# Altium schematic sheet UART.SchDoc
size A; SheetNumber: 4; SheetTotal: 6
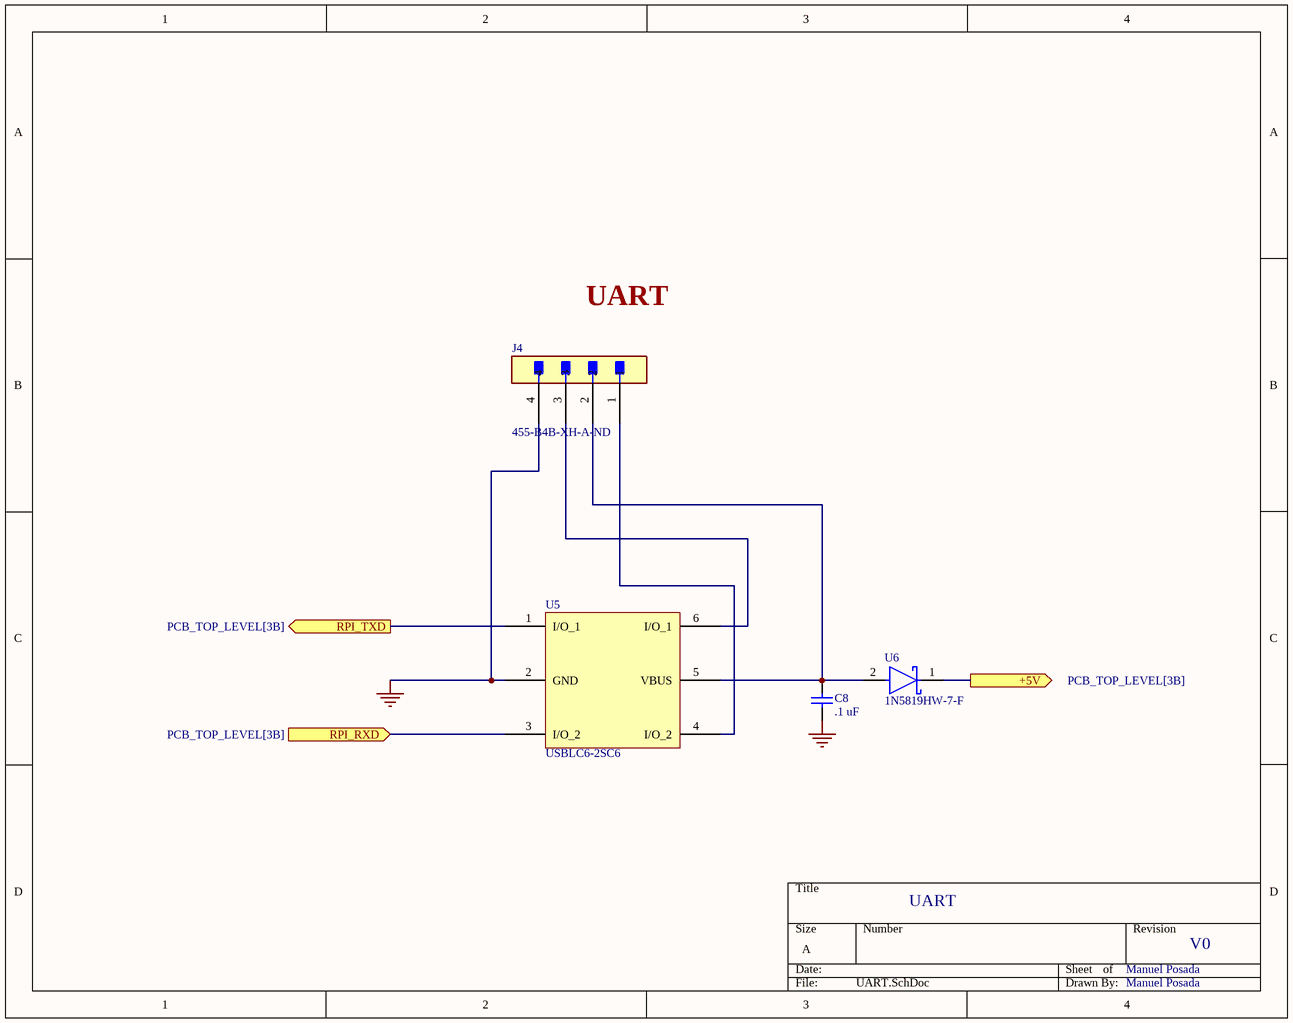
[diagram p0: UART.SchDoc]

## Parts
C8  .1 uF  [CAP_CL21_SAM-L]
J4  455-B4B-XH-A-ND  [CONN_B4B-XH-A_JST]
U5  USBLC6-2SC6  [SOT23-6L_STM]
U6  1N5819HW-7-F  [FP-SOD123-IPC_B]

## Ports
+5V (out, see PCB_TOP_LEVEL[3B]), RPI_RXD (in, see PCB_TOP_LEVEL[3B]), RPI_TXD (out, see PCB_TOP_LEVEL[3B])

## Nets
GND: C8.1 J4.4 U5.2(GND)
+5V: U6.1(C) ; port +5V
RPI_RXD: U5.3(I/O_2) ; port RPI_RXD
RPI_TXD: U5.1(I/O_1) ; port RPI_TXD
NetC8_2: C8.2 J4.2 U5.5(VBUS) U6.2(A)
NetJ4_1: J4.1 U5.4(I/O_2)
NetJ4_3: J4.3 U5.6(I/O_1)

## Notes on the sheet
- UART
- Manuel Posada
- V0

## Library data of the parts
C8 = CL21B104KBCNNNC: 50V 100nF X7R ±10% 0805 Multilayer Ceramic Capacitors MLCC - SMD/SMT ROHS; Manufacturer: Samsung Electro-Mechanics; Supplier: DigiKey; Supplier Part Number: 1276-1003-6-ND; Manufacturer Part Number: CL21B104KBCNNNC; RoHS: Compliant; Category: Ceramic Capacitors; Stock: 2859375; Pricing: 1=0.08, 10=0.006 (USD); Value: 100nF; Case/Package: 0805; Case Code (Imperial): 0805; Case Code (Metric): 2012; China RoHS: Compliant; Contact Plating: Tin; Country of Origin: Mainland China, Philippines, South Korea; Depth: 1.25mm; Dielectric: X7R; Dielectric Material: Ceramic; Export Control Classification Number (ECCN) Code: EAR99; Height: 950µm; Harmonized Tariff Schedule (HTS) Code: 8532.24.00.20; Introduction Date: 2009-07-27; Lead Free: Lead Free; Length: 2mm; Lifecycle Status: Production; Material: Ceramic; Max Operating Temperature: 125°C; Min Operating Temperature: -55°C; Mounting Technology: Surface Mount; Number of Terminals: 2; Radiation Hardening: No; REACH SVHC: Yes; Schedule B: 8532240020, 8532240020|8532240020, 8532240020|8532240020|8532240020, 8532240020|8532240020|8532240020|8532240020; Thickness: 939.8µm; Tolerance: 10%; Voltage: 50V; Voltage Rating: 50V; Voltage Rating (DC): 50V; Width: 1.25mm; ComponentLink1URL: https://datasheet.octopart.com:443/CL21B104KBCNNNC-Samsung-Electro-Mechanics-datasheet-137745078.pdf?src-supplier=IHS; ComponentLink1Description: https://datasheet.octopart.com:443/CL21B104KBCNNNC-Samsung-Electro-Mechanics-datasheet-137745078.pdf?src-supplier=IHS; ComponentLink2URL: https://datasheet.octopart.com/CL21B104KBCNNNC-Samsung-Electro-Mechanics-datasheet-8324245.pdf; ComponentLink2Description: https://datasheet.octopart.com/CL21B104KBCNNNC-Samsung-Electro-Mechanics-datasheet-8324245.pdf; ComponentLink3URL: https://datasheet.octopart.com/CL21B104KBCNNNC-Samsung-Electro-Mechanics-datasheet-97040617.pdf; ComponentLink3Description: https://datasheet.octopart.com/CL21B104KBCNNNC-Samsung-Electro-Mechanics-datasheet-97040617.pdf; ComponentLink4URL: https://datasheet.octopart.com:443/CL21B104KBCNNNC-Samsung-Electro-Mechanics-datasheet-11548950.pdf?src-supplier=Future+Electronics; ComponentLink4Description: https://datasheet.octopart.com:443/CL21B104KBCNNNC-Samsung-Electro-Mechanics-datasheet-11548950.pdf?src-supplier=Future+Electronics; ComponentLink5URL: https://datasheet.octopart.com:443/CL21B104KBCNNNC-Samsung-Electro-Mechanics-datasheet-116891032.pdf?src-supplier=Future+Electronics; ComponentLink5Description: https://datasheet.octopart.com:443/CL21B104KBCNNNC-Samsung-Electro-Mechanics-datasheet-116891032.pdf?src-supplier=Future+Electronics; ComponentLink6URL: https://datasheet.octopart.com:443/CL21B104KBCNNNC-Samsung-Electro-Mechanics-datasheet-81462175.pdf?src-supplier=Future+Electronics; ComponentLink6Description: https://datasheet.octopart.com:443/CL21B104KBCNNNC-Samsung-Electro-Mechanics-datasheet-81462175.pdf?src-supplier=Future+Electronics; ComponentLink7URL: https://datasheet.octopart.com:443/CL21B104KBCNNNC-Samsung-datasheet-42485244.pdf?src-supplier=Future+Electronics; ComponentLink7Description: https://datasheet.octopart.com:443/CL21B104KBCNNNC-Samsung-datasheet-42485244.pdf?src-supplier=Future+Electronics; ComponentLink8URL: https://datasheet.octopart.com:443/CL21B104KBCNNNC-Samsung-Electro-Mechanics-datasheet-149045937.pdf?src-supplier=Future+Electronics; ComponentLink8Description: https://datasheet.octopart.com:443/CL21B104KBCNNNC-Samsung-Electro-Mechanics-datasheet-149045937.pdf?src-supplier=Future+Electronics; ComponentLink9URL: https://datasheet.octopart.com:443/CL21B104KBCNNNC-Samsung-datasheet-8326407.pdf?src-supplier=TME; ComponentLink9Description: https://datasheet.octopart.com:443/CL21B104KBCNNNC-Samsung-datasheet-8326407.pdf?src-supplier=TME
J4 = B4B-XH-A: Board Connector, 4 Contact(s), 1 Row(s), Male, Straight, Solder Terminal; Manufacturer: JST; Contact Resistance: 20mΩ; Current Rating: 3A; Insulation Resistance: 1GΩ; Supplier: DigiKey; Supplier Part Number: 455-B4B-XH-A-ND; Manufacturer Part Number: B4B-XH-A; RoHS: Compliant; Category: Card Edge Connectors; Stock: 88606; Pricing: 1=0.14, 10=0.12, 100=0.1021, 500=0.09114, 1000=0.08679, 5000=0.07746, 10000=0.07376 (USD); Contact Gender: Male; Contact Material: Bronze, Tin; Export Control Classification Number (ECCN) Code: EAR99; Housing Material: Nylon; Harmonized Tariff Schedule (HTS) Code: 8536.69.40.40; Introduction Date: 1997-11-01; Lifecycle Status: Production; Max Operating Temperature: 85°C; Min Operating Temperature: -25°C; Pins: 4; Number of Rows: 1; Orientation: Straight; Terminal Pitch: 2.5mm; ComponentLink1URL: https://datasheet.octopart.com:443/B4B-XH-A-JST-datasheet-157850277.pdf?src-supplier=IHS; ComponentLink1Description: https://datasheet.octopart.com:443/B4B-XH-A-JST-datasheet-157850277.pdf?src-supplier=IHS; ComponentLink2URL: https://datasheet.octopart.com:443/B4B-XH-A-JST-datasheet-10026044.pdf?src-supplier=TME; ComponentLink2Description: https://datasheet.octopart.com:443/B4B-XH-A-JST-datasheet-10026044.pdf?src-supplier=TME
U5 = USBLC6-2SC6: 17V Clamp 5A (8/20µs) Ipp Tvs Diode Surface Mount SOT-23-6; Manufacturer: STMicroelectronics; Breakdown Voltage: 6V; Value: 2.5pF; Data Rate: 480Mbps; Direction: Unidirectional; Element Configuration: Dual; ESD Protection: Yes; Forward Voltage: 1.1V; Leakage Current: 150nA; Max Junction Temperature (Tj): 125°C; Max Repetitive Reverse Voltage (Vrrm): 5.25V; Number of Bidirectional Channels: 2; Number of Elements: 1; Reverse Standoff Voltage: 5V; Test Current: 1mA; Supplier: DigiKey; Supplier Part Number: 497-5235-1-ND; Manufacturer Part Number: USBLC6-2SC6; RoHS: Compliant; Category: TVS Diodes; Stock: 229189; Pricing: 1=0.36, 10=0.243, 100=0.163, 500=0.127, 1000=0.114, 3000=0.077, 6000=0.076, 9000=0.075 (USD); Case/Package: SOT-23; China RoHS: Compliant; Clamping Voltage: 17V; Contact Plating: Tin; Country of Origin: Mainland China; Depth: 1.75mm; Export Control Classification Number (ECCN) Code: EAR99; Height: 1.45mm; Harmonized Tariff Schedule (HTS) Code: 8541.10.00.50; Introduction Date: 2005-03-15; Lead Free: Lead Free; Length: 3.05mm; Lifecycle Status: Production; Max Breakdown Voltage: 6V; Max Operating Temperature: 125°C; Max Reverse Leakage Current: 150nA; Min Breakdown Voltage: 6V; Min Operating Temperature: -40°C; Mounting Technology: Surface Mount; Number of Channels: 2; Pins: 6; Number of Terminals: 6; Operating Supply Voltage: 1.1V; Peak Pulse Current: 5A; Peak Reverse Current: 150nA; Polarity: Unidirectional; Power Line Protection: Yes; Radiation Hardening: No; REACH SVHC: Yes; Reverse Breakdown Voltage: 6V; Schedule B: 8536300000, 8536300000|8536300000|8536300000|8536300000|8536300000|8536300000|8536300000|8536300000|8536300000|8536300000|8536300000|8536300000|8536300000|8536300000|8536300000|8536300000|8536300000|8536300000|8536300000|8536300000|8536300000|8536300000|8536300000|85; Termination: SMD/SMT; Width: 1.75mm; Working Voltage: 5V; ComponentLink1URL: https://datasheet.octopart.com:443/USBLC6-2SC6-STMicroelectronics-datasheet-10412581.pdf?src-supplier=Newark; ComponentLink1Description: https://datasheet.octopart.com:443/USBLC6-2SC6-STMicroelectronics-datasheet-10412581.pdf?src-supplier=Newark; ComponentLink2URL: https://datasheet.octopart.com:443/USBLC6-2SC6-STMicroelectronics-datasheet-181961833.pdf?src-supplier=Newark; ComponentLink2Description: https://datasheet.octopart.com:443/USBLC6-2SC6-STMicroelectronics-datasheet-181961833.pdf?src-supplier=Newark; ComponentLink3URL: https://datasheet.octopart.com:443/USBLC6-2SC6-STMicroelectronics-datasheet-525477.pdf?src-supplier=Factory+Futures; ComponentLink3Description: https://datasheet.octopart.com:443/USBLC6-2SC6-STMicroelectronics-datasheet-525477.pdf?src-supplier=Factory+Futures; ComponentLink4URL: https://datasheet.octopart.com:443/USBLC6-2SC6-STMicroelectronics-datasheet-82998616.pdf?src-supplier=Farnell; ComponentLink4Description: https://datasheet.octopart.com:443/USBLC6-2SC6-STMicroelectronics-datasheet-82998616.pdf?src-supplier=Farnell; ComponentLink5URL: https://datasheet.octopart.com:443/USBLC6-2SC6-STMicroelectronics-datasheet-46285.pdf?src-supplier=Farnell; ComponentLink5Description: https://datasheet.octopart.com:443/USBLC6-2SC6-STMicroelectronics-datasheet-46285.pdf?src-supplier=Farnell; ComponentLink6URL: https://datasheet.octopart.com:443/USBLC6-2SC6-STMicroelectronics-datasheet-14050643.pdf?src-supplier=iiiC; ComponentLink6Description: https://datasheet.octopart.com:443/USBLC6-2SC6-STMicroelectronics-datasheet-14050643.pdf?src-supplier=iiiC; ComponentLink7URL: https://datasheet.octopart.com:443/USBLC6-2SC6-STMicroelectronics-datasheet-10521292.pdf?src-supplier=Jameco; ComponentLink7Description: https://datasheet.octopart.com:443/USBLC6-2SC6-STMicroelectronics-datasheet-10521292.pdf?src-supplier=Jameco
U6 = 1N5819HW-7-F: DIODE SCHOTTKY 40V 1A SOD123; Manufacturer: Diodes Inc.; Value: 50pF; Element Configuration: Single; Forward Voltage: 750mV; Max Forward Surge Current (Ifsm): 25A; Max Junction Temperature (Tj): 125°C; Max Power Dissipation: 450mW; Number of Elements: 1; Peak Reverse Current: 1mA; Polarity: Standard; Supplier: DigiKey; Supplier Part Number: 1N5819HW-FDICT-ND; Manufacturer Part Number: 1N5819HW-7-F; RoHS: Compliant; Category: Schottky Diodes; Stock: 184558; Pricing: 1=0.29, 10=0.166, 100=0.1036, 500=0.07624, 1000=0.06736, 3000=0.0505, 6000=0.044, 9000=0.03923, 15000=0.039, 21000=0.03886, 30000=0.03872, 75000=0.03561, 150000=0.0323 (USD); Average Rectified Current: 1A; Case/Package: SOD-123-2; China RoHS: Compliant; Contact Plating: Tin; Current Rating: 1A; Forward Current: 1A; Height: 1.45mm; Lead Free: Lead Free; Length: 2.85mm; Lifecycle Status: Production; Max Operating Temperature: 125°C; Max Output current: 1A; Max Repetitive Reverse Voltage (Vrrm): 40V; Max Reverse Voltage (DC): 40V; Min Breakdown Voltage: 40V; Min Operating Temperature: -65°C; Pins: 2; Number of Terminals: 2; Output Current: 1A; Packaging: Tape and Reel; Peak Non-Repetitive Surge Current: 25A; Radiation Hardening: No; REACH SVHC: Yes; Reverse Standoff Voltage: 40V; Reverse Voltage: 40V; Schedule B: 8541100080, 8541100080|8541100080|8541100080|8541100080|8541100080; Termination: SMD/SMT; Voltage Rating (DC): 40V; Weight: 10.007382mg; Width: 1.7mm; ComponentLink1URL: https://datasheet.octopart.com:443/1N5819HW-7-F-Diodes-Inc.-datasheet-180549196.pdf?src-supplier=IHS; ComponentLink1Description: https://datasheet.octopart.com:443/1N5819HW-7-F-Diodes-Inc.-datasheet-180549196.pdf?src-supplier=IHS; ComponentLink2URL: https://datasheet.octopart.com:443/1N5819HW-7-F-Diodes-Inc.-datasheet-8332965.pdf?src-supplier=Upverter; ComponentLink2Description: https://datasheet.octopart.com:443/1N5819HW-7-F-Diodes-Inc.-datasheet-8332965.pdf?src-supplier=Upverter; ComponentLink3URL: https://sigma.octopart.com:443/138895985/technical_drawing/Diodes-Inc.-1N5819HW-7-F.pdf?src-supplier=Upverter; ComponentLink3Description: https://sigma.octopart.com:443/138895985/technical_drawing/Diodes-Inc.-1N5819HW-7-F.pdf?src-supplier=Upverter; ComponentLink4URL: https://datasheet.octopart.com:443/1N5819HW-7-F-Diodes-Inc.-datasheet-134530231.pdf?src-supplier=Future+Electronics; ComponentLink4Description: https://datasheet.octopart.com:443/1N5819HW-7-F-Diodes-Inc.-datasheet-134530231.pdf?src-supplier=Future+Electronics; ComponentLink5URL: https://datasheet.octopart.com:443/1N5819HW-7-F-Diodes-Inc.-datasheet-34441420.pdf?src-supplier=Future+Electronics; ComponentLink5Description: https://datasheet.octopart.com:443/1N5819HW-7-F-Diodes-Inc.-datasheet-34441420.pdf?src-supplier=Future+Electronics; ComponentLink6URL: https://datasheet.octopart.com:443/1N5819HW-7-F-Diodes-Inc.-datasheet-10497210.pdf?src-supplier=Future+Electronics; ComponentLink6Description: https://datasheet.octopart.com:443/1N5819HW-7-F-Diodes-Inc.-datasheet-10497210.pdf?src-supplier=Future+Electronics; ComponentLink7URL: https://datasheet.octopart.com:443/1N5819HW-7-F-Diodes-Inc.-datasheet-169364014.pdf?src-supplier=Newark; ComponentLink7Description: https://datasheet.octopart.com:443/1N5819HW-7-F-Diodes-Inc.-datasheet-169364014.pdf?src-supplier=Newark; ComponentLink8URL: https://datasheet.octopart.com:443/1N5819HW-7-F-Diodes-Inc.-datasheet-78715396.pdf?src-supplier=Newark; ComponentLink8Description: https://datasheet.octopart.com:443/1N5819HW-7-F-Diodes-Inc.-datasheet-78715396.pdf?src-supplier=Newark; ComponentLink9URL: https://datasheet.octopart.com:443/1N5819HW-7-F-Diodes-Inc.-datasheet-14053419.pdf?src-supplier=iiiC; ComponentLink9Description: https://datasheet.octopart.com:443/1N5819HW-7-F-Diodes-Inc.-datasheet-14053419.pdf?src-supplier=iiiC; ComponentLink10URL: https://datasheet.octopart.com:443/1N5819HW-7-F-Diodes-Inc.-datasheet-7274306.pdf?src-supplier=Jameco; ComponentLink10Description: https://datasheet.octopart.com:443/1N5819HW-7-F-Diodes-Inc.-datasheet-7274306.pdf?src-supplier=Jameco; ComponentLink11URL: https://datasheet.octopart.com:443/1N5819HW-7-F-Diodes-Inc.-datasheet-16627.pdf?src-supplier=Mouser; ComponentLink11Description: https://datasheet.octopart.com:443/1N5819HW-7-F-Diodes-Inc.-datasheet-16627.pdf?src-supplier=Mouser; ComponentLink12URL: https://datasheet.octopart.com:443/1N5819HW-7-F-Diodes-Inc.-datasheet-145195.pdf?src-supplier=DigiKey; ComponentLink12Description: https://datasheet.octopart.com:443/1N5819HW-7-F-Diodes-Inc.-datasheet-145195.pdf?src-supplier=DigiKey; ComponentLink13URL: http://sigma.octopart.com:80/15616867/materials_sheet/Diodes-Inc.-1N5819HW-7-F.pdf?src-supplier=Compliance+Statements; ComponentLink13Description: http://sigma.octopart.com:80/15616867/materials_sheet/Diodes-Inc.-1N5819HW-7-F.pdf?src-supplier=Compliance+Statements